# EAGLE design v1 (EAGLE 9.6.2)
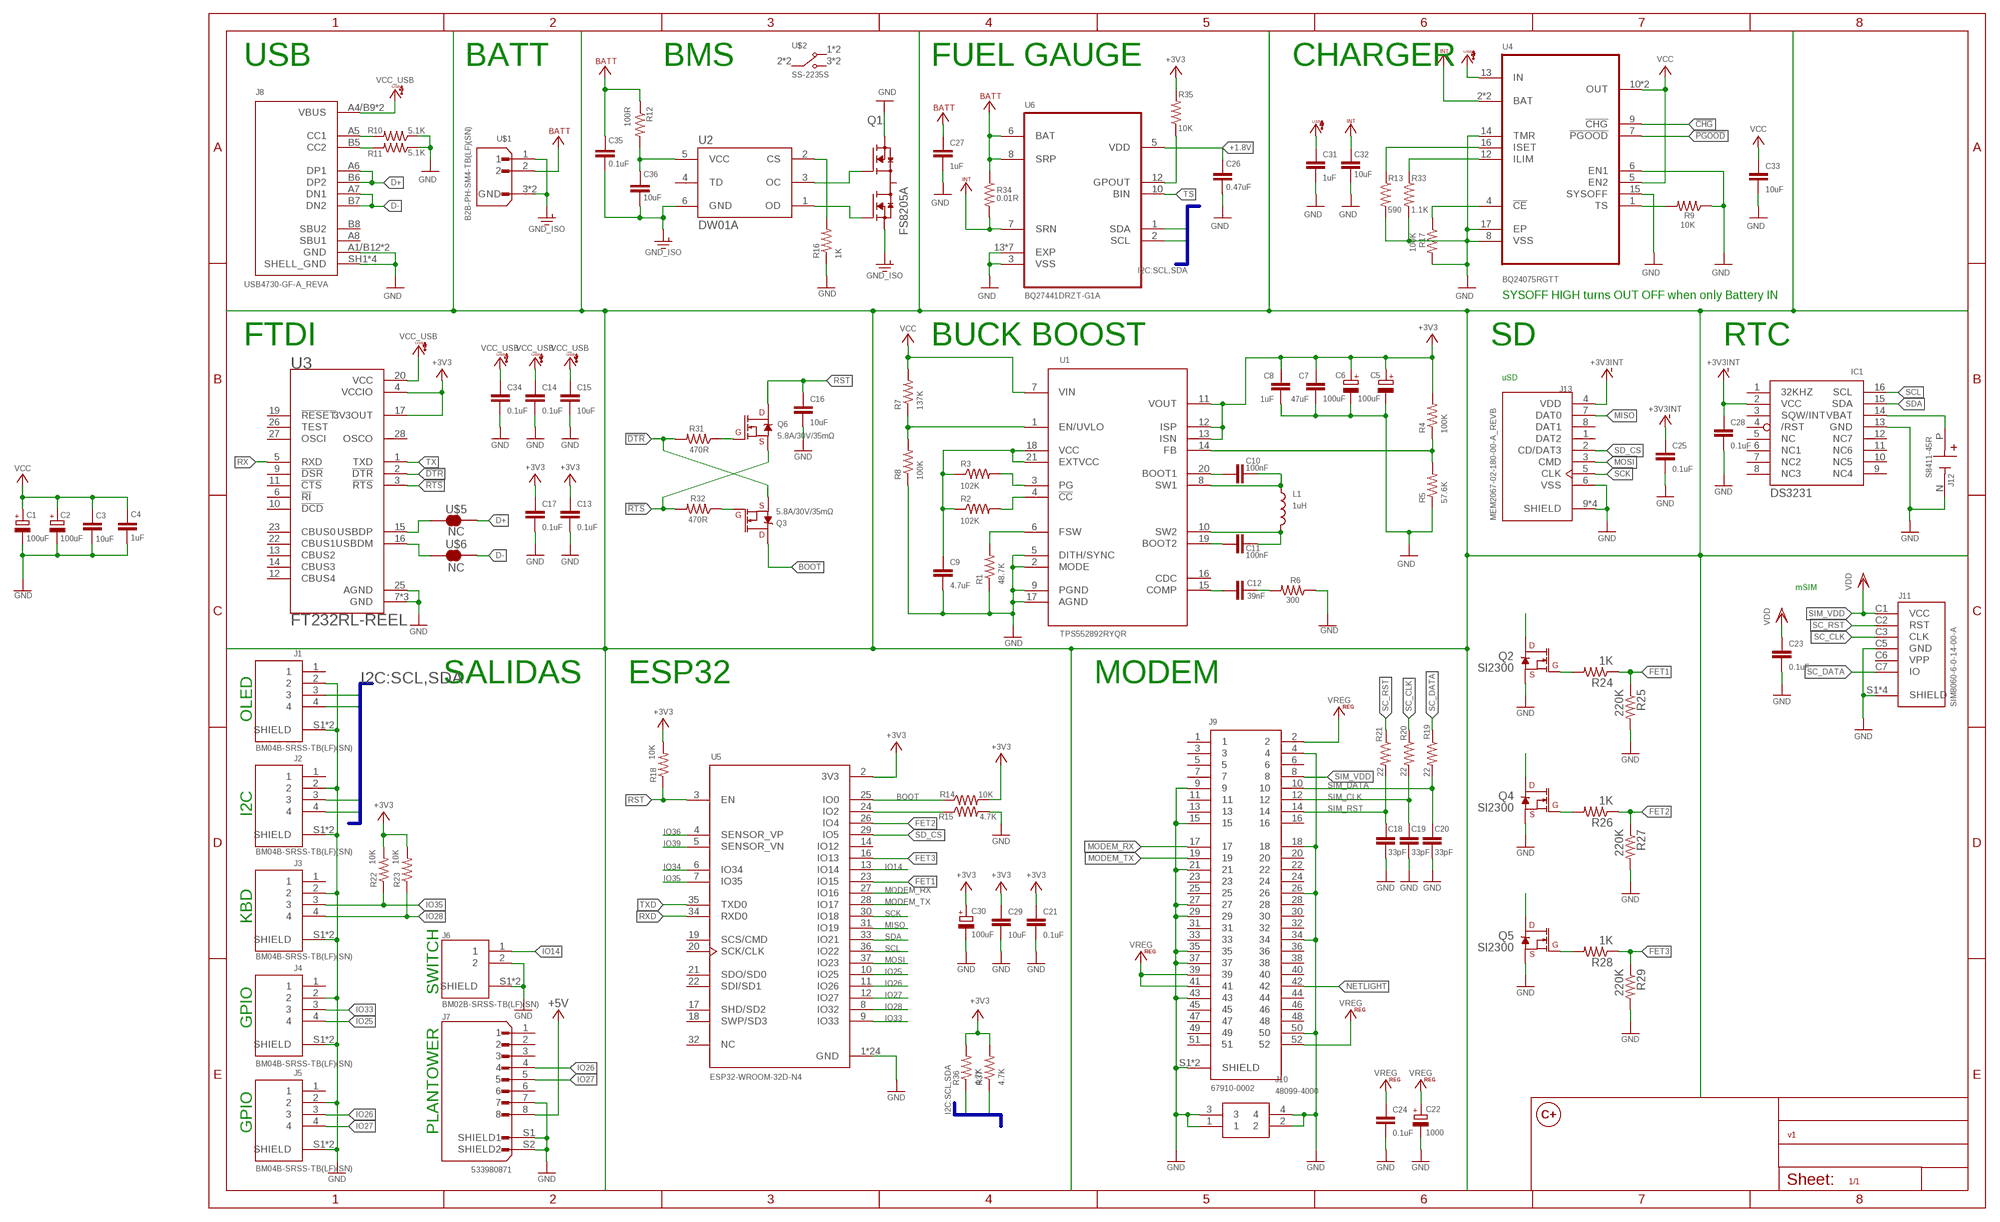
[diagram p0: schematic, sheet 1]

## Parts
C1  100uF  CPOL-EUSMCB  [SMC_B]
C2  100uF  CPOL-EUSMCB  [SMC_B]
C3  10uF  C-EUC0805  [C0805]
C4  1uF  C-EUC0805  [C0805]
C5  100uF  CPOL-EUSMCB  [SMC_B]
C6  100uF  CPOL-EUSMCB  [SMC_B]
C7  47uF  C-EUC0805  [C0805]
C8  1uF  C-EUC0805  [C0805]
C9  4.7uF  C-EUC0805  [C0805]
C10  100nF  C-EUC0805  [C0805]
C11  100nF  C-EUC0805  [C0805]
C12  39nF  C-EUC0805  [C0805]
C13  0.1uF  C-EUC0805  [C0805]
C14  0.1uF  C-EUC0805  [C0805]
C15  10uF  C-EUC0805  [C0805]
C16  10uF  C-EUC0805  [C0805]
C17  0.1uF  C-EUC0805  [C0805]
C18  33pF  C-EUC0805  [C0805]
C19  33pF  C-EUC0805  [C0805]
C20  33pF  C-EUC0805  [C0805]
C21  0.1uF  C-EUC0805  [C0805]
C22  1000  CPOL-EUSMCD  [SMC_D]
C23  0.1uF  C-EUC0805  [C0805]
C24  0.1uF  C-EUC0805  [C0805]
C25  0.1uF  C-EUC0805  [C0805]
C26  0.47uF  C-EUC0805  [C0805]
C27  1uF  C-EUC0805  [C0805]
C28  0.1uF  C-EUC0805  [C0805]
C29  10uF  C-EUC0805  [C0805]
C30  100uF  CPOL-EUCT3528  [CT3528]
C31  1uF  C-EUC0805  [C0805]
C32  10uF  C-EUC0805  [C0805]
C33  10uF  C-EUC0805  [C0805]
C34  0.1uF  C-EUC0805  [C0805]
C35  0.1uF  C-EUC0805  [C0805]
C36  10uF  C-EUC0805  [C0805]
IC1  DS3231/SO  [SO16W]
J1  BM04B-SRSS-TB(LF)(SN)  [JST_BM04B-SRSS-TB(LF)(SN)]
J2  BM04B-SRSS-TB(LF)(SN)  [JST_BM04B-SRSS-TB(LF)(SN)]
J3  BM04B-SRSS-TB(LF)(SN)  [JST_BM04B-SRSS-TB(LF)(SN)]
J4  BM04B-SRSS-TB(LF)(SN)  [JST_BM04B-SRSS-TB(LF)(SN)]
J5  BM04B-SRSS-TB(LF)(SN)  [JST_BM04B-SRSS-TB(LF)(SN)]
J6  BM02B-SRSS-TB(LF)(SN)  [JST_BM02B-SRSS-TB(LF)(SN)]
J7  533980871  [MOLEX_533980871]
J8  USB4730-GF-A_REVA  [GCT_USB4730-GF-A_REVA]
J9  67910-0002  [MOLEX_67910-0002]
J10  48099-4000  [480994000]
J11  SIM8060-6-0-14-00-A  [GCT_SIM8060-6-0-14-00-A]
J12  S8411-45R  [HARWIN_S8411-45R]
J13  MEM2067-02-180-00-A_REVB  [GCT_MEM2067-02-180-00-A_REVB]
L1  1uH  MDH7045C-220MA=P3  [IND_MDH7045C-220MA=P3]
Q1  FS8205A  FS8205ASOT95P280X145-6N  [SOT95P280X145-6N]
Q2  SI2300  MOSFET-NCH-AO3404A  [SOT23-3]
Q3  5.8A/30V/35mΩ  MOSFET-NCH-AO3404A  [SOT23-3]
Q4  SI2300  MOSFET-NCH-AO3404A  [SOT23-3]
Q5  SI2300  MOSFET-NCH-AO3404A  [SOT23-3]
Q6  5.8A/30V/35mΩ  MOSFET-NCH-AO3404A  [SOT23-3]
R1  48.7K  R-US_R0805  [R0805]
R2  102K  R-US_R0805  [R0805]
R3  102K  R-US_R0805  [R0805]
R4  100K  R-US_R0805  [R0805]
R5  57.6K  R-US_R0805  [R0805]
R6  300  R-US_R0805  [R0805]
R7  137K  R-US_R0805  [R0805]
R8  100K  R-US_R0805  [R0805]
R9  10K  R-US_R0805  [R0805]
R10  5.1K  R-US_R0805  [R0805]
R11  5.1K  R-US_R0805  [R0805]
R12  100R  R-US_R0805  [R0805]
R13  590  R-US_R0805  [R0805]
R14  10K  R-US_R0805  [R0805]
R15  4.7K  R-US_R0805  [R0805]
R16  1K  R-US_R0805  [R0805]
R17  100K  R-US_R0805  [R0805]
R18  10K  R-US_R0805  [R0805]
R19  22  R-US_R0805  [R0805]
R20  22  R-US_R0805  [R0805]
R21  22  R-US_R0805  [R0805]
R22  10K  R-US_R0805  [R0805]
R23  10K  R-US_R0805  [R0805]
R24  1K  R-US_R0805  [R0805]
R25  220K  R-US_R0805  [R0805]
R26  1K  R-US_R0805  [R0805]
R27  220K  R-US_R0805  [R0805]
R28  1K  R-US_R0805  [R0805]
R29  220K  R-US_R0805  [R0805]
R31  470R  R-US_R0805  [R0805]
R32  470R  R-US_R0805  [R0805]
R33  1.1K  R-US_R0805  [R0805]
R34  0.01R  R-US_R1206  [R1206]
R35  10K  R-US_R0805  [R0805]
R36  4.7K  R-US_R0805  [R0805]
R37  4.7K  R-US_R0805  [R0805]
U1  TPS552892RYQR  [CONV_TPS552892RYQR]
U2  DW01A  [SOT23-6]
U3  FT232RL-REEL  [SOP65P780X200-28N]
U4  BQ24075RGTT  [QFN50P300X300X100-17N]
U5  ESP32-WROOM-32D-N4  [MODULE_ESP32-WROOM-32D-N4]
U6  BQ27441DRZT-G1A  [IC_BQ27441DRZR-G1A]
U$1  B2B-PH-SM4-TB(LF)(SN)  [JST_B2B-PH-SM4-TB(LF)(SN)]
U$2  SS-2235S  [SS-2235S]
U$3  LOGO_CMAS10MM  [LOGO_10MM]
U$5  NC  SMT-JUMPER-2_NC  [SMT-JUMPER-2_NC]
U$6  NC  SMT-JUMPER-2_NC  [SMT-JUMPER-2_NC]

## Nets
!CHG: U4.9(!CHG)
!DTR: Q3.2(S) R31.2 U3.2(!DTR)
!PGOOD: U4.7(!PGOOD)
!RTS: Q6.2(S) R32.2 U3.3(!RTS)
+1.8V: C26.1 U6.5(VDD)
+3V3: C5.+ C6.+ C7.1 C8.1 C13.1 C17.1 C21.1 C29.1 C30.+ R4.2 R14.2 R18.2 R22.2 R23.2 R35.2 R36.2 R37.2 U1.11(VOUT) U1.12(ISP) U1.13(ISN) U3.4(VCCIO) U3.17(3V3OUT) U5.2(3V3)
+3V3INT: C25.1 C28.1 IC1.2(VCC) J13.4(VDD)
+5V: J7.8
BOOT: Q3.3(D) R14.1 U5.25(IO0)
D+: J8.A6(DP1) J8.B6(DP2) U$5.2
D-: J8.A7(DN1) J8.B7(DN2) U$6.2
FET1: R24.1 R25.1 U5.23(IO15)
FET2: R26.1 R27.1 U5.26(IO4)
FET3: R28.1 R29.1 U5.16(IO13)
GND: C1.- C2.- C3.2 C4.2 C5.- C6.- C7.2 C8.2 C9.2 C13.2 C14.2 C15.2 C16.2 C17.2 C18.2 C19.2 C20.2 C21.2 C22.- C23.2 C24.2 C25.2 C26.2 C27.2 C28.2 C29.2 C30.- C31.2 C32.2 C33.2 C34.2 IC1.13(GND) J1.2 J1.S1(SHIELD) J1.S2(SHIELD) J2.2 J2.S1(SHIELD) J2.S2(SHIELD) J3.2 J3.S1(SHIELD) J3.S2(SHIELD) J4.2 J4.S1(SHIELD) J4.S2(SHIELD) J5.2 J5.S1(SHIELD) J5.S2(SHIELD) J6.2 J6.S1(SHIELD) J6.S2(SHIELD) J7.7 J7.S1(SHIELD1) J7.S2(SHIELD2) J8.A1/B12(GND) J8.B1/A12(GND) J8.SH1(SHELL_GND) J8.SH2(SHELL_GND) J8.SH3(SHELL_GND) J8.SH4(SHELL_GND) J9.4 J9.9 J9.15 J9.18 J9.21 J9.26 J9.27 J9.29 J9.34 J9.35 J9.37 J9.43 J9.50 J9.S1(SHIELD) J9.S2(SHIELD) J10.1 J10.2 J10.3 J10.4 J11.C5(GND) J11.S1(SHIELD) J11.S2(SHIELD) J11.S3(SHIELD) J11.S4(SHIELD) J12.N(-) J13.6(VSS) J13.9(SHIELD) J13.10(SHIELD) J13.11(SHIELD) J13.12(SHIELD) Q1.3(S2) Q2.2(S) Q4.2(S) Q5.2(S) R1.1 R5.1 R6.1 R8.1 R9.1 R10.1 R11.1 R13.2 R15.2 R16.1 R17.2 R25.2 R27.2 R29.2 R33.2 U1.2(MODE) U1.5(DITH/SYNC) U1.9(PGND) U1.17(AGND) U3.7(GND) U3.18(GND) U3.21(GND) U3.25(AGND) U4.6(EN1) U4.8(VSS) U4.14(TMR) U4.15(SYSOFF) U4.17(EP) U5.1(GND) U5.15(GND) U5.38(GND) U5.39_1(GND) U5.39_2(GND) U5.39_3(GND) U5.39_4(GND) U5.39_5(GND) U5.39_6(GND) U5.39_7(GND) U5.39_8(GND) U5.39_9(GND) U5.39_10(GND) U5.39_11(GND) U5.39_12(GND) U5.39_13(GND) U5.39_14(GND) U5.39_15(GND) U5.39_16(GND) U5.39_17(GND) U5.39_18(GND) U5.39_19(GND) U5.39_20(GND) U5.39_21(GND) U6.3(VSS) U6.13(EXP) U6.14(EXP) U6.15(EXP) U6.16(EXP) U6.17(EXP) U6.18(EXP) U6.19(EXP)
GND_ISO: C35.2 C36.2 Q1.1(S1) U2.6(GND) U$1.1 U$1.3(GND) U$1.4(GND)
GPOUT: R35.1 U6.12(GPOUT)
IO14: J6.1 U5.13(IO14)
IO25: J4.4 U5.10(IO25)
IO26: J5.3 J7.4 U5.11(IO26)
IO27: J5.4 J7.5 U5.12(IO27)
IO28: J3.4 R23.1 U5.8(IO32)
IO33: J4.3 U5.9(IO33)
IO34: U5.6(IO34)
IO35: J3.3 R22.1 U5.7(IO35)
IO36: U5.4(SENSOR_VP)
IO39: U5.5(SENSOR_VN)
MISO: J13.7(DAT0) U5.31(IO19)
MODEM_RX: J9.17 U5.27(IO16)
MODEM_TX: J9.19 U5.28(IO17)
MOSI: J13.3(CMD) U5.37(IO23)
N$1: R2.2 U1.4(!CC)
N$2: C12.1 U1.15(COMP)
N$3: C12.2 R6.2
N$4: R1.2 U1.6(FSW)
N$5: R3.2 U1.3(PG)
N$6: C9.1 R2.1 R3.1 U1.18(VCC) U1.21(EXTVCC)
N$7: R4.1 R5.2 U1.14(FB)
N$8: C11.2 L1.2 U1.10(SW2)
N$9: C10.1 U1.20(BOOT1)
N$10: C10.2 L1.1 U1.8(SW1)
N$11: C11.1 U1.19(BOOT2)
N$12: R7.1 R8.2 U1.1(EN/UVLO)
N$13: J8.A5(CC1) R10.2
N$14: J8.B5(CC2) R11.2
N$15: Q1.4(G2) U2.3(OC)
N$16: Q1.6(G1) U2.1(OD)
N$17: C36.1 R12.2 U2.5(VCC)
N$18: IC1.14(VBAT) J12.P(+)
N$19: U3.15(USBDP) U$5.1
N$20: U3.16(USBDM) U$6.1
N$21: R9.2 U4.1(TS)
N$22: R13.1 U4.16(ISET)
N$23: R33.1 U4.12(ILIM)
N$24: R15.1 U5.24(IO2)
N$25: Q6.1(G) R31.1
N$26: Q3.1(G) R32.1
N$27: R16.2 U2.2(CS)
N$28: R17.1 U4.4(!CE)
N$30: Q2.3(D)
N$31: Q2.1(G) R24.2
N$32: Q4.3(D)
N$33: Q4.1(G) R26.2
N$34: Q5.3(D)
N$35: Q5.1(G) R28.2
NETLIGHT: J9.42
RST: C16.1 Q6.3(D) R18.1 U5.3(EN)
RX: U3.5(RXD)
RXD: U5.34(RXD0)
SC_CLK: J11.C3(CLK) R20.1
SC_DATA: J11.C7(IO) R19.1
SC_RST: J11.C2(RST) R21.1
SCK: J13.5(CLK) U5.30(IO18)
SCL: IC1.16(SCL) J1.4 J2.4 R37.1 U5.36(IO22) U6.2(SCL)
SD_CS: J13.2(CD/DAT3) U5.29(IO5)
SDA: IC1.15(SDA) J1.3 J2.3 R36.1 U5.33(IO21) U6.1(SDA)
SIM_CLK: C19.1 J9.12 R20.2
SIM_DATA: C20.1 J9.10 R19.2
SIM_RST: C18.1 J9.14 R21.2
SIM_VDD: C23.1 J9.8 J11.C1(VCC) ; supply symbol labelled VDD
TS: U6.10(BIN)
TX: U3.1(TXD)
TXD: U5.35(TXD0)
VBAT: C27.1 C35.1 R12.1 R34.1 U6.6(BAT) U6.8(SRP) U$1.2
VCC: C1.+ C2.+ C3.1 C4.1 C33.1 R7.2 U1.7(VIN) U4.5(EN2) U4.10(OUT) U4.11(OUT)
VCC_USB: C14.1 C15.1 C31.1 C34.1 J8.A4/B9(VBUS) J8.B4/A9(VBUS) U3.20(VCC) U4.13(IN)
VCCINT: C32.1 R34.2 U4.2(BAT) U4.3(BAT) U6.7(SRN)
VREG: C22.+ C24.1 J9.2 J9.39 J9.41 J9.52
Unconnected: IC1.1(32KHZ) IC1.3(SQW/INT) IC1.4(/RST) IC1.5(NC) IC1.6(NC1) IC1.7(NC2) IC1.8(NC3) IC1.9(NC4) IC1.10(NC5) IC1.11(NC6) IC1.12(NC7) J1.1 J2.1 J3.1 J4.1 J5.1 J7.1 J7.2 J7.3 J7.6 J8.A8(SBU1) J8.B8(SBU2) J9.1 J9.3 J9.5 J9.6 J9.7 J9.11 J9.13 J9.16 J9.20 J9.22 J9.23 J9.24 J9.25 J9.28 J9.30 J9.31 J9.32 J9.33 J9.36 J9.38 J9.40 J9.44 J9.45 J9.46 J9.47 J9.48 J9.49 J9.51 J11.C6(VPP) J13.1(DAT2) J13.8(DAT1) Q1.2(D12) Q1.5(D12) U1.16(CDC) U2.4(TD) U3.6(!RI) U3.9(!DSR) U3.10(!DCD) U3.11(!CTS) U3.12(CBUS4) U3.13(CBUS2) U3.14(CBUS3) U3.19(!RESET) U3.22(CBUS1) U3.23(CBUS0) U3.26(TEST) U3.27(OSCI) U3.28(OSCO) U5.14(IO12) U5.17(SHD/SD2) U5.18(SWP/SD3) U5.19(SCS/CMD) U5.20(SCK/CLK) U5.21(SDO/SD0) U5.22(SDI/SD1) U5.32(NC) U$2.1(T1) U$2.2(P1) U$2.3(T2) U$2.4(T1) U$2.5(P1) U$2.6(T2)

## Buses
I2C:SCL,SDA

## Notes on the sheet
- USB | BATT | BMS | FUEL GAUGE | CHARGER
- SYSOFF HIGH turns OUT OFF when only Battery IN
- FTDI | BUCK BOOST | SD | RTC
- uSD
- mSIM
- SALIDAS | ESP32 | MODEM
- OLED
- I2C
- KBD
- SWITCH
- GPIO
- GPIO | PLANTOWER

## Library data of the parts
C1 C2 C5 C6 C22 C30 = rcl:CPOL-EU: POLARIZED CAPACITOR, European symbol; SPICEPREFIX: C
C3 C4 C7-C21 C23-C29 C31-C36 = rcl:C-EU: CAPACITOR, European symbol; SPICEPREFIX: C
IC1 = DS3231:DS3231: Check availability <https://pricing.snapeda.com/parts/DS3231/Analog%20Devices/view-part?ref=eda>; AVAILABILITY: In Stock; CHECK_PRICES: https://www.snapeda.com/parts/DS3231/Analog+Devices/view-part/?ref=eda; DESCRIPTION: Real Time Clock (RTC) IC Clock/Calendar - I²C, 2-Wire Serial 8-SOIC (0.154, 3.90mm Width); MF: Analog Devices; MP: DS3231; PACKAGE: SOIC-16 Maxim Integrated; PRICE: None; SNAPEDA_LINK: https://www.snapeda.com/parts/DS3231/Analog+Devices/view-part/?ref=snap
J1-J5 = con-jst_sh:BM04B-SRSS-TB(LF)(SN): Check availability <https://pricing.snapeda.com/parts/BM04B-SRSS-TB%28LF%29%28SN%29/JST%20Sales/view-part?ref=eda>; AVAILABILITY: In Stock; CHECK_PRICES: https://www.snapeda.com/parts/BM04B-SRSS-TB(LF)(SN)/JST/view-part/?ref=eda; DESCRIPTION: Connector Header Surface Mount 4 position 0.039 (1.00mm); MF: JST Sales; MP: BM04B-SRSS-TB(LF)(SN); PACKAGE: None; PRICE: None; SNAPEDA_LINK: https://www.snapeda.com/parts/BM04B-SRSS-TB(LF)(SN)/JST/view-part/?ref=snap
J6 = con-jst_sh:BM02B-SRSS-TB(LF)(SN): Check availability <https://pricing.snapeda.com/parts/BM02B-SRSS-TB%20%28LF%29%28SN%29/JST%20Corporation/view-part?ref=eda>; AVAILABILITY: In Stock; CHECK_PRICES: https://www.snapeda.com/parts/BM02B-SRSS-TB%20(LF)(SN)/JST/view-part/?ref=eda; DESCRIPTION: Connector Header Surface Mount 2 position 0.039 (1.00mm); MF: JST Corporation; MP: BM02B-SRSS-TB (LF)(SN); PACKAGE: None; PRICE: None; SNAPEDA_LINK: https://www.snapeda.com/parts/BM02B-SRSS-TB%20(LF)(SN)/JST/view-part/?ref=snap
J7 = 533980871:533980871: Check availability <https://pricing.snapeda.com/parts/53398-0871/Molex/view-part?ref=eda>; AVAILABILITY: In Stock; CHECK_PRICES: https://www.snapeda.com/parts/53398-0871/Molex/view-part/?ref=eda; DESCRIPTION: Conn; Rect; Header; 1.25 mm Pitch; PCB; 8 Cir; Ver; SMT; PicoBlade; LF | Molex Incorporated 53398-0871; MF: Molex; MP: 53398-0871; PACKAGE: None; PRICE: None; SNAPEDA_LINK: https://www.snapeda.com/parts/53398-0871/Molex/view-part/?ref=snap
J8 = con-usb:USB4730-GF-A_REVA: Check availability <https://pricing.snapeda.com/parts/USB4730-GF-A/Global%20Connector%20Technology/view-part?ref=eda>; AVAILABILITY: In Stock; CHECK_PRICES: https://www.snapeda.com/parts/USB4730-GF-A/Global+Connector+Technology/view-part/?ref=eda; DESCRIPTION: USB-C (USB TYPE-C) USB 2.0 Receptacle Connector 24 (16+8 Dummy) Position Surface Mount, Right Angle; Through Hole; LCSC: C5446865; MF: Global Connector Technology; MP: USB4730-GF-A; PACKAGE: None; PRICE: None; SNAPEDA_LINK: https://www.snapeda.com/parts/USB4730-GF-A/Global+Connector+Technology/view-part/?ref=snap
J9 = 67910-0002:67910-0002: 52 Position Female Connector PCI Express Mini Card Gold 0.031" (0.80mm) Black Check prices <https://pricing.snapeda.com/parts/67910-0002/Molex/view-part?ref=eda>; AVAILABILITY: In Stock; DESCRIPTION: 52 Position Female Connector PCI Express Mini Card Gold 0.031 (0.80mm) Black; MF: Molex; MP: 67910-0002; PACKAGE: None; PRICE: None
J10 = mPCIe:48099-4000: Molex 48099 Series, Card Holder for use with Mini PCIe, PCI Source: Datasheet <https://media.digikey.com/pdf/Data Sheets/Molex PDFs/480994000_Dwg.pdf>; DESCRIPTION: Molex 48099 Series, Card Holder for use with Mini PCIe, PCI; HEIGHT: 4.8mm; MANUFACTURER_NAME: Molex; MANUFACTURER_PART_NUMBER: 48099-4000; MOUSER_PART_NUMBER: 538-48099-4000; MOUSER_PRICE-STOCK: https://www.mouser.co.uk/ProductDetail/Molex/48099-4000?qs=dsreSLQWyj8b%2FXEoksc%2Fog%3D%3D
J11 = simCardHolder:SIM8060-6-0-14-00-A: SIM8060 is a hinged Sim Card Connector. With 6 contacts, with switch for card detection. Profile above PCB is 1.43mm. Check availability <https://pricing.snapeda.com/parts/SIM8060-6-0-14-00-A/Global%20Connector%20Technology/view-part?ref=eda>; AVAILABILITY: In Stock; CHECK_PRICES: https://www.snapeda.com/parts/SIM8060-6-0-14-00-A/Global+Connector+Technology/view-part/?ref=eda; DESCRIPTION: 6 Position Card Connector NANO SIM Surface Mount, Right Angle Gold; MF: Global Connector Technology; MP: SIM8060-6-0-14-00-A; PACKAGE: None; PRICE: None; SNAPEDA_LINK: https://www.snapeda.com/parts/SIM8060-6-0-14-00-A/Global+Connector+Technology/view-part/?ref=snap
J12 = S8411-45R:S8411-45R: Check availability <https://pricing.snapeda.com/parts/S8411-45R/Harwin/view-part?ref=eda>; AVAILABILITY: In Stock; CHECK_PRICES: https://www.snapeda.com/parts/S8411-45R/Harwin/view-part/?ref=eda; DESCRIPTION: Coin Cell Battery Retainer, Horizontal SMT, for CR1220 Coin Cell Batteries, Tape & Reeled; MF: Harwin; MP: S8411-45R; PACKAGE: None; PRICE: None; SNAPEDA_LINK: https://www.snapeda.com/parts/S8411-45R/Harwin/view-part/?ref=snap
J13 = microsd:MEM2067-02-180-00-A_REVB: Check availability <https://pricing.snapeda.com/parts/MEM2067-02-180-00-A/Global%20Connector%20Technology/view-part?ref=eda>; AVAILABILITY: In Stock; CHECK_PRICES: https://www.snapeda.com/parts/MEM2067-02-180-00-A/Global+Connector+Technology/view-part/?ref=eda; DESCRIPTION: 8 Position Card Connector microSD Surface Mount, Right Angle Gold; MF: Global Connector Technology; MP: MEM2067-02-180-00-A; PACKAGE: None; PRICE: None; SNAPEDA_LINK: https://www.snapeda.com/parts/MEM2067-02-180-00-A/Global+Connector+Technology/view-part/?ref=snap
L1 = MDH7045C-220MA_P3:MDH7045C-220MA=P3: Inductor Power Shielded Wirewound 100uH 20% 100KHz Ferrite 0.8A 0.377Ohm DCR 2928 Automotive T/R Check availability <https://pricing.snapeda.com/parts/MDH7045C-220MA%3DP3/Murata/view-part?ref=eda>; AVAILABILITY: In Stock; CHECK_PRICES: https://www.snapeda.com/parts/MDH7045C-220MA=P3/Murata/view-part/?ref=eda; DESCRIPTION: Inductor with Inductance: 22uH Tol. +/-20%, Package: 2928 (7470); MF: Murata; MP: MDH7045C-220MA=P3; PACKAGE: NONSTANDARD; PRICE: None; SNAPEDA_LINK: https://www.snapeda.com/parts/MDH7045C-220MA=P3/Murata/view-part/?ref=snap
Q1 = FS8205A:FS8205A: N/A Check availability <https://pricing.snapeda.com/parts/FS8205A/Fortune%20Semiconductor/view-part?ref=eda>
Q2 Q4 Q5 = transistor:MOSFET-NCH: N-channel MOSFETs Voltage controlled devices that allow control of high current outputs. SparkFun Products: SparkFun OpenScale <https://www.sparkfun.com/products/13261> SparkFun Digital Sandbox <https://www.sparkfun.com/products/12651> SparkFun Monster Moto Shield <https://www.sparkfun.com/products/10182> SparkFun MOSFET Power Controller <https://www.sparkfun.com/products/11214>; PROD_ID: TRANS-12988; VALUE: 5.8A/30V/35mΩ
Q3 Q6 = transistor:MOSFET-NCH: N-channel MOSFETs Voltage controlled devices that allow control of high current outputs. SparkFun Products: SparkFun OpenScale <https://www.sparkfun.com/products/13261> SparkFun Digital Sandbox <https://www.sparkfun.com/products/12651> SparkFun Monster Moto Shield <https://www.sparkfun.com/products/10182> SparkFun MOSFET Power Controller <https://www.sparkfun.com/products/11214>; PROD_ID: TRANS-12988
R1-R29 R31-R37 = rcl:R-US_: RESISTOR, American symbol; SPICEPREFIX: R
U1 = TPS552892RYQR:TPS552892RYQR: Check availability <https://pricing.snapeda.com/parts/TPS552892RYQR/Texas%20Instruments/view-part?ref=eda>; AVAILABILITY: In Stock; CHECK_PRICES: https://www.snapeda.com/parts/TPS552892RYQR/Texas+Instruments/view-part/?ref=eda; DESCRIPTION: 36-V 8-A fully-integrated buck-boost converter; MF: Texas Instruments; MP: TPS552892RYQR; PACKAGE: None; PRICE: None; SNAPEDA_LINK: https://www.snapeda.com/parts/TPS552892RYQR/Texas+Instruments/view-part/?ref=snap
U2 = DW01A:DW01A: The DW01A battery protection IC is designed to protect lithium-ion/polymer battery from damage or degrading the lifetime due to overcharge, overdischarge, and/or overcurrent for one-cell lithium-ion/polymer battery powered systems, such as cellular phones. Check availability <https://pricing.snapeda.com/parts/DW01A/Fortune%20Semiconductor/view-part?ref=eda>; AVAILABILITY: Not in stock; CHECK_PRICES: https://www.snapeda.com/parts/DW01A/Fortune+Semiconductor/view-part/?ref=eda; DESCRIPTION: One Cell Lithium-ion/Polymer Battery Protection IC; MF: Fortune Semiconductor; MP: DW01A; PACKAGE: SOT-23-6 Fortune Semiconductor; PRICE: None; SNAPEDA_LINK: https://www.snapeda.com/parts/DW01A/Fortune+Semiconductor/view-part/?ref=snap
U3 = FT232RL-REEL:FT232RL-REEL: USB Full Speed to Serial UART IC, Includes Oscillator and EEPROM - SSOP-28 Check availability <https://pricing.snapeda.com/parts/FT232RL-REEL/FTDI%2C/view-part?ref=eda>; AVAILABILITY: In Stock; CHECK_PRICES: https://www.snapeda.com/parts/FT232RL-REEL/FTDI%252C+Future+Technology+Devices+International+Ltd/view-part/?ref=eda; DESCRIPTION: USB Bridge, USB to UART USB 2.0 UART Interface 28-SSOP; MF: FTDI,; MP: FT232RL-REEL; PACKAGE: SSOP-28 FTDI; PRICE: None; PURCHASE-URL: https://pricing.snapeda.com/search?q=FT232RL-REEL&ref=eda; SNAPEDA_LINK: https://www.snapeda.com/parts/FT232RL-REEL/FTDI%252C+Future+Technology+Devices+International+Ltd/view-part/?ref=snap
U4 = BQ24075RGTT:BQ24075RGTT: Check availability <https://pricing.snapeda.com/parts/BQ24075RGTT/Texas%20Instruments/view-part?ref=eda>; AVAILABILITY: In Stock; CHECK_PRICES: https://www.snapeda.com/parts/BQ24075RGTT/Texas+Instruments/view-part/?ref=eda; DESCRIPTION: Standalone 1-cell 1.5-A linear battery charger, Power Path, 4.2-V VBAT and 5.5-V VOUT; MF: Texas Instruments; MP: BQ24075RGTT; PACKAGE: VQFN-16 Texas Instruments; PRICE: None; SNAPEDA_LINK: https://www.snapeda.com/parts/BQ24075RGTT/Texas+Instruments/view-part/?ref=snap
U5 = ESP32-WROOM-32D-N4:ESP32-WROOM-32D-N4: Check availability <https://pricing.snapeda.com/parts/ESP32-WROOM-32D-N4/Espressif%20Systems/view-part?ref=eda>; AVAILABILITY: In Stock; CHECK_PRICES: https://www.snapeda.com/parts/ESP32-WROOM-32D-N4/Espressif+Systems/view-part/?ref=eda; DESCRIPTION: Bluetooth, WiFi 802.11b/g/n, Bluetooth v4.2 +EDR, Class 1, 2 and 3 Transceiver Module 2.4GHz ~ 2.5GHz Integrated, Trace Surface Mount; MF: Espressif Systems; MP: ESP32-WROOM-32D-N4; PACKAGE: Non Standard Espressif Systems; PRICE: None; SNAPEDA_LINK: https://www.snapeda.com/parts/ESP32-WROOM-32D-N4/Espressif+Systems/view-part/?ref=snap
U6 = BQ27441DRZT-G1A:BQ27441DRZT-G1A: Check availability <https://pricing.snapeda.com/parts/BQ27441DRZT-G1A/Texas%20Instruments/view-part?ref=eda>; AVAILABILITY: In Stock; CHECK_PRICES: https://www.snapeda.com/parts/BQ27441DRZT-G1A/Texas+Instruments/view-part/?ref=eda; DESCRIPTION: System-side Impedance Track™ battery fuel (gas) gauge; MF: Texas Instruments; MP: BQ27441DRZT-G1A; PACKAGE: VSON-12 Texas Instruments; PRICE: None; SNAPEDA_LINK: https://www.snapeda.com/parts/BQ27441DRZT-G1A/Texas+Instruments/view-part/?ref=snap
U$1 = con-jst_ph:B2B-PH-SM4-TB(LF)(SN): Japan solderless terminals. 2mm pitch, 2 pins. Check availability <https://pricing.snapeda.com/parts/B2B-PH-SM4-TB%28LF%29%28SN%29/JST%20Sales/view-part?ref=eda>; AVAILABILITY: In Stock; CHECK_PRICES: https://www.snapeda.com/parts/B2B-PH-SM4-TB(LF)(SN)/JST+Sales+America+Inc./view-part/?ref=eda; DESCRIPTION: Connector Header Surface Mount 2 position 0.079 (2.00mm); MF: JST Sales; MP: B2B-PH-SM4-TB(LF)(SN); PACKAGE: NON STANDARD-2 JST; PRICE: None; SNAPEDA_LINK: https://www.snapeda.com/parts/B2B-PH-SM4-TB(LF)(SN)/JST+Sales+America+Inc./view-part/?ref=snap
U$2 = switch_slide:SS-2235S
U$3 = logoCmas:LOGO_CMAS
U$5 U$6 = solderpad:SMT-JUMPER-2_NC

## Net classes
0 default: width 0.61 mm

## Board
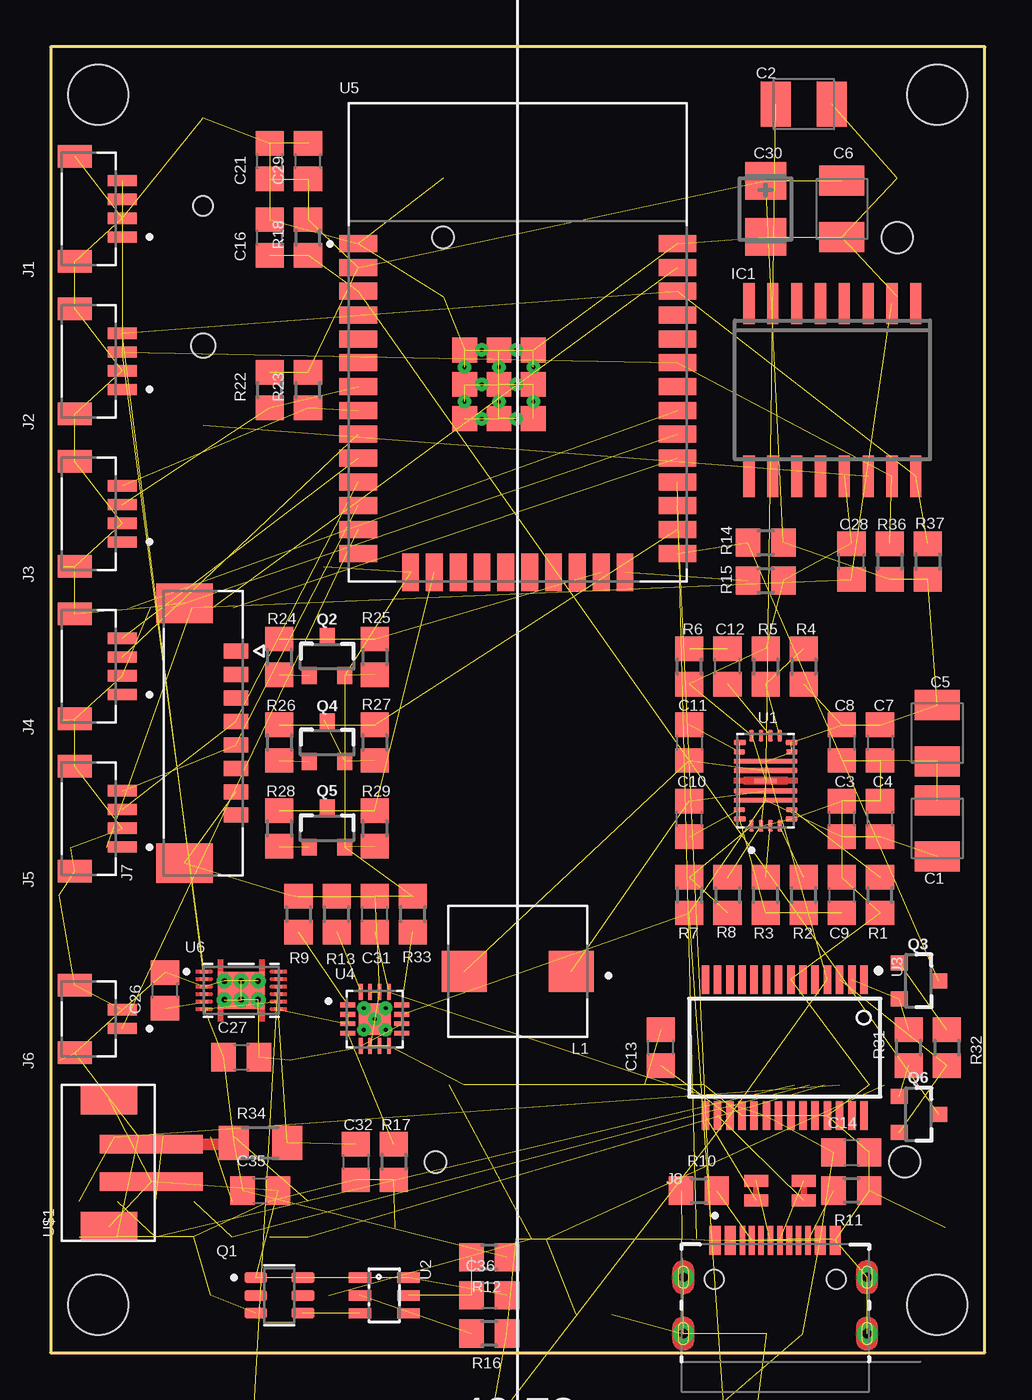
[diagram p1: board, top side]
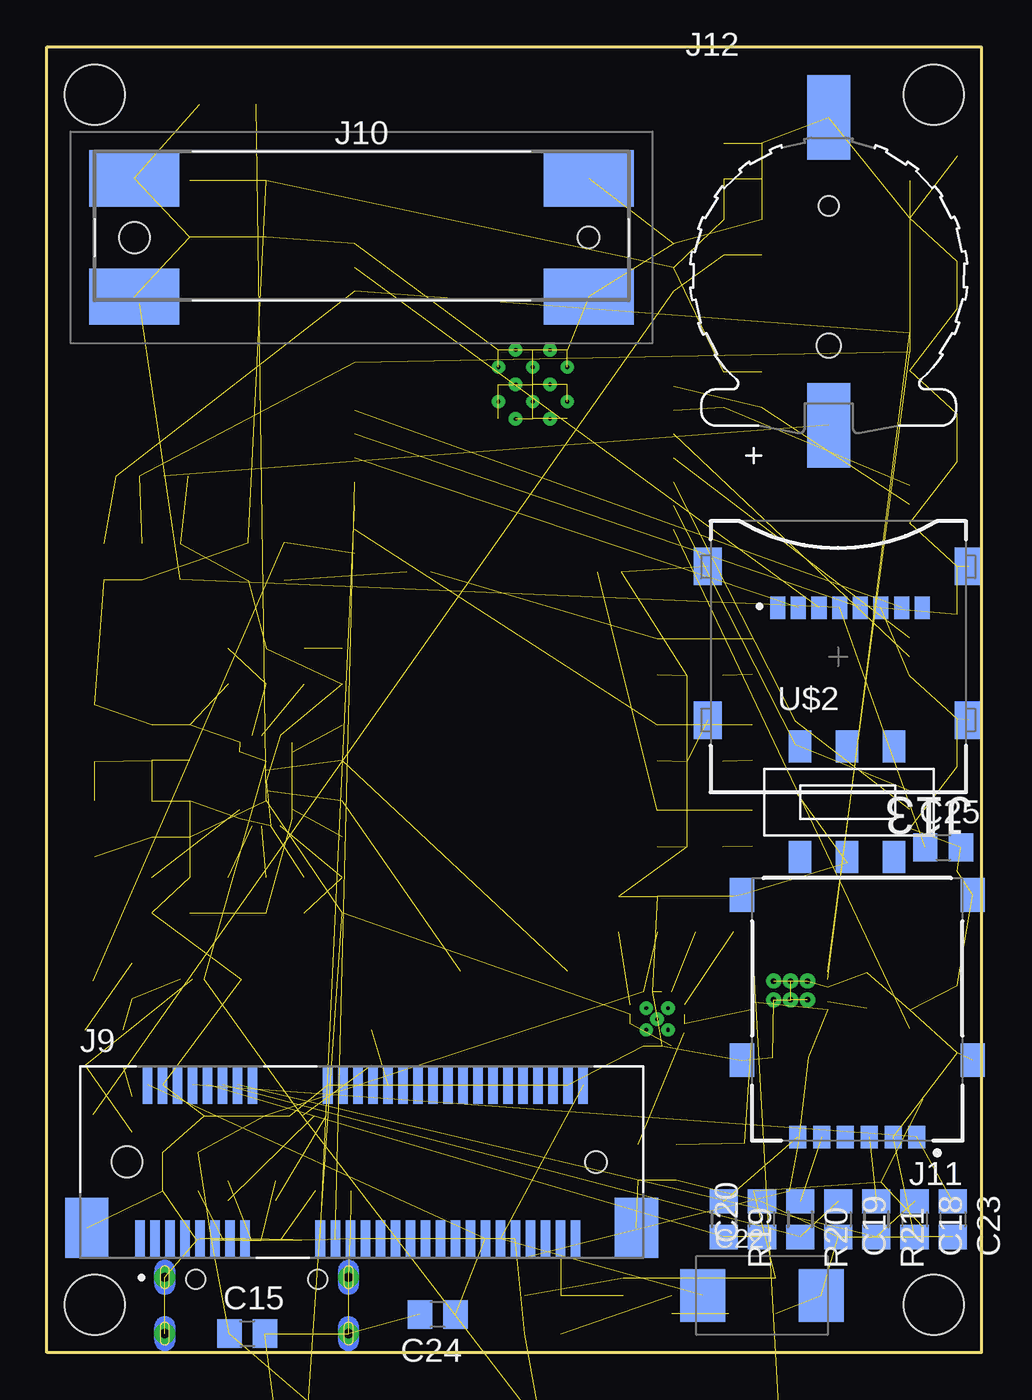
[diagram p2: board, bottom side, seen from below]

Size 49.78 x 69.6 mm. Coordinates in mm from the lower left corner, seen from the top.
Outline: 0,69.6 0,0 49.78,0 49.78,69.6 0,69.6
Copper layers (1*16): Top 0.035mm / dielectric 1.5mm / Bottom 0.035mm
Design rules "OthermillDRC_30_deg_005": minimum track width 6mil, minimum drill 0.8mm, track to track 8mil, track to pad 8mil, pad to pad 8mil, via to via 8mil, smd to smd 0mil, copper to edge 0mil, drill to drill 6mil, minimum pad ring 10mil, minimum via ring 10mil, stop-mask expansion 1mil, vias tented up to drill 30mil, thermal gap 6mil
Holes 3.2 mm at 2.54,67.06 47.24,2.54 47.24,67.06 2.54,2.54

### Footprints (pad centres in the part's own frame; a part is rotated, then mirrored left to right if it is on the bottom)
SMC_B = smd 1.6 x 2.4: + -1.5,0; - 1.5,0
C0805 = smd 1.3 x 1.5: 1 -0.95,0; 2 0.95,0
SMC_D = smd 2.4 x 2.8: + -3.15,0; - 3.15,0
CT3528 = smd 2 x 2.2: + -1.5,0; - 1.5,0
SO16W = smd 0.6 x 2.2: 1 -4.445,-4.6; 2 -3.175,-4.6; 3 -1.905,-4.6; 4 -0.635,-4.6; 5 0.635,-4.6; 6 1.905,-4.6; 7 3.175,-4.6; 8 4.445,-4.6; 9 4.445,4.6; 10 3.175,4.6; 11 1.905,4.6; 12 0.635,4.6; 13 -0.635,4.6; 14 -1.905,4.6; 15 -3.175,4.6; 16 -4.445,4.6
JST_BM04B-SRSS-TB(LF)(SN) = smd 0.6 x 1.55: 1 -1.5,-1.775; 2 -0.5,-1.775; 3 0.5,-1.775; 4 1.5,-1.775 | smd 1.2 x 1.8: S1 -2.8,0.75; S2 2.8,0.75
JST_BM02B-SRSS-TB(LF)(SN) = smd 0.6 x 1.55: 1 -0.5,-1.775; 2 0.5,-1.775 | smd 1.2 x 1.8: S1 -1.8,0.75; S2 1.8,0.75
MOLEX_533980871 = smd 0.8 x 1.3: 1 4.375,-1.75; 2 3.125,-1.75; 3 1.875,-1.75; 4 0.625,-1.75; 5 -0.625,-1.75; 6 -1.875,-1.75; 7 -3.125,-1.75; 8 -4.375,-1.75 | smd 2.1 x 3: S1 -6.925,1; S2 6.925,1
GCT_USB4730-GF-A_REVA = smd 0.6 x 1.55: A1/B12 -3.2,4.975; A4/B9 -2.4,4.975; B1/A12 3.2,4.975; B4/A9 2.4,4.975 | smd 0.3 x 1.55: A5 -1.25,4.975; A6 -0.25,4.975; A7 0.25,4.975; A8 1.25,4.975; B5 1.75,4.975; B6 0.75,4.975; B7 -0.75,4.975; B8 -1.75,4.975 | drill 0.5 pad 1.1: SH1 -4.895,0; SH2 4.895,0; SH3 -4.895,3; SH4 4.895,3 | hole 1.02: -3.25,2.9; 3.25,2.9
MOLEX_67910-0002 = smd 0.508 x 2: 1 -11.8,-4.1; 2 -11.4,4.1; 3 -11,-4.1; 4 -10.6,4.1; 5 -10.2,-4.1; 6 -9.8,4.1; 7 -9.4,-4.1; 8 -9,4.1; 9 -8.6,-4.1; 10 -8.2,4.1; 11 -7.8,-4.1; 12 -7.4,4.1; 13 -7,-4.1; 14 -6.6,4.1; 15 -6.2,-4.1; 16 -5.8,4.1; 17 -2.2,-4.1; 18 -1.8,4.1; 19 -1.4,-4.1; 20 -1,4.1; 21 -0.6,-4.1; 22 -0.2,4.1; 23 0.2,-4.1; 24 0.6,4.1; 25 1,-4.1; 26 1.4,4.1; 27 1.8,-4.1; 28 2.2,4.1; 29 2.6,-4.1; 30 3,4.1; 31 3.4,-4.1; 32 3.8,4.1; 33 4.2,-4.1; 34 4.6,4.1; 35 5,-4.1; 36 5.4,4.1; 37 5.8,-4.1; 38 6.2,4.1; 39 6.6,-4.1; 40 7,4.1; 41 7.4,-4.1; 42 7.8,4.1; 43 8.2,-4.1; 44 8.6,4.1; 45 9,-4.1; 46 9.4,4.1; 47 9.8,-4.1; 48 10.2,4.1; 49 10.6,-4.1; 50 11,4.1; 51 11.4,-4.1; 52 11.8,4.1 | smd 2.3 x 3.2: S1 -14.65,-3.5; S2 14.65,-3.5 | hole 1.65: -12.5,0 | hole 1.15: 12.5,0
480994000 = smd 4.8 x 3: 1 -12.1,-3.15; 2 12.1,-3.15; 3 -12.1,3.15; 4 12.1,3.15 | hole 1.65: -12.1,0 | hole 1.15: 12.1,0
GCT_SIM8060-6-0-14-00-A = smd 0.9 x 1.2: C1 -3.175,6.8; C2 -0.635,6.8; C3 1.905,6.8; C5 -1.905,6.8; C6 0.635,6.8; C7 3.175,6.8 | smd 1.3 x 1.8: S1 -6.15,2.7; S2 6.15,2.7; S3 6.15,-6.1; S4 -6.15,-6.1
HARWIN_S8411-45R = smd 2.3 x 4.5: N 0,8.425; P 0,-7.975 | hole 1.05: 0,3.725 | hole 1.3: 0,-3.725
GCT_MEM2067-02-180-00-A_REVB = smd 0.8 x 1.2: 1 3.225,-2.625; 2 2.125,-2.625; 3 1.025,-2.625; 4 -0.075,-2.625; 5 -1.175,-2.625; 6 -2.275,-2.625; 7 -3.375,-2.625; 8 -4.475,-2.625 | smd 1.5 x 2: 9 -6.945,-4.825; 10 -6.945,3.375; 11 6.945,3.375; 12 6.945,-4.825
IND_MDH7045C-220MA=P3 = smd 2.4 x 2.2: 1 -2.85,0; 2 2.85,0
SOT95P280X145-6N = smd 1.21 x 0.59: 1 -1.255,0.95; 2 -1.255,0; 3 -1.255,-0.95; 4 1.255,-0.95; 5 1.255,0; 6 1.255,0.95
SOT23-3 = smd 0.8 x 0.9: 1 -0.95,-1; 2 0.95,-1; 3 0,1.1
R0805 = smd 1.3 x 1.5: 1 -0.95,0; 2 0.95,0
R1206 = smd 1.6 x 1.803: 1 -1.422,0; 2 1.422,0
CONV_TPS552892RYQR = smd 0.6 x 0.25: 1 -2.4,0.75; 2 -2.4,0.25; 3 -2.4,-0.25; 4 -2.4,-0.75; 14 2.4,-0.75; 15 2.4,-0.25; 16 2.4,0.25; 17 2.4,0.75 | smd 0.25 x 0.65: 5 -2.04,-1.375; 13 2.04,-1.375; 18 2.04,1.375; 21 -2.04,1.375 | smd 0.25 x 0.6: 6 -1.54,-1.4; 12 1.54,-1.4; 19 1.54,1.4; 20 -1.54,1.4 | smd 0.25 x 3.4: 7 -1.04,0; 8 -0.54,0; 10 0.54,0; 11 1.04,0 | smd 0.25 x 1.2: 9 0,0
SOT23-6 = smd 0.55 x 1.2: 1 -0.95,-1.3; 2 0,-1.3; 3 0.95,-1.3; 4 0.95,1.3; 5 0,1.3; 6 -0.95,1.3
SOP65P780X200-28N = smd 1.5 x 0.4: 1 -3.625,4.225; 2 -3.625,3.575; 3 -3.625,2.925; 4 -3.625,2.275; 5 -3.625,1.625; 6 -3.625,0.975; 7 -3.625,0.325; 8 -3.625,-0.325; 9 -3.625,-0.975; 10 -3.625,-1.625; 11 -3.625,-2.275; 12 -3.625,-2.925; 13 -3.625,-3.575; 14 -3.625,-4.225; 15 3.625,-4.225; 16 3.625,-3.575; 17 3.625,-2.925; 18 3.625,-2.275; 19 3.625,-1.625; 20 3.625,-0.975; 21 3.625,-0.325; 22 3.625,0.325; 23 3.625,0.975; 24 3.625,1.625; 25 3.625,2.275; 26 3.625,2.925; 27 3.625,3.575; 28 3.625,4.225
QFN50P300X300X100-17N = smd 0.86 x 0.26: 1 -1.435,0.75; 2 -1.435,0.25; 3 -1.435,-0.25; 4 -1.435,-0.75; 9 1.435,-0.75; 10 1.435,-0.25; 11 1.435,0.25; 12 1.435,0.75 | smd 0.26 x 0.86: 5 -0.75,-1.435; 6 -0.25,-1.435; 7 0.25,-1.435; 8 0.75,-1.435; 13 0.75,1.435; 14 0.25,1.435; 15 -0.25,1.435; 16 -0.75,1.435 | smd 1.68 x 1.68: 17 0,0 | drill 0.2 pad 0.4: 18 0,0; 19 -0.58,0.58; 20 0.58,0.58; 21 -0.58,-0.58; 22 0.58,-0.58
MODULE_ESP32-WROOM-32D-N4 = smd 2 x 0.9: 1 -8.5,5.26; 2 -8.5,3.99; 3 -8.5,2.72; 4 -8.5,1.45; 5 -8.5,0.18; 6 -8.5,-1.09; 7 -8.5,-2.36; 8 -8.5,-3.63; 9 -8.5,-4.9; 10 -8.5,-6.17; 11 -8.5,-7.44; 12 -8.5,-8.71; 13 -8.5,-9.98; 14 -8.5,-11.25; 25 8.5,-11.25; 26 8.5,-9.98; 27 8.5,-8.71; 28 8.5,-7.44; 29 8.5,-6.17; 30 8.5,-4.9; 31 8.5,-3.63; 32 8.5,-2.36; 33 8.5,-1.09; 34 8.5,0.18; 35 8.5,1.45; 36 8.5,2.72; 37 8.5,3.99; 38 8.5,5.26 | smd 0.9 x 2: 15 -5.715,-12.25; 16 -4.445,-12.25; 17 -3.175,-12.25; 18 -1.905,-12.25; 19 -0.635,-12.25; 20 0.635,-12.25; 21 1.905,-12.25; 22 3.175,-12.25; 23 4.445,-12.25; 24 5.715,-12.25 | smd 1.33 x 1.33: 39_1 -2.835,-0.405; 39_2 -1,-0.405; 39_3 0.835,-0.405; 39_4 -2.835,-2.24; 39_5 -1,-2.24; 39_6 0.835,-2.24; 39_7 -2.835,-4.075; 39_8 -1,-4.075; 39_9 0.835,-4.075 | drill 0.2 pad 0.3: 39_10 -1.917,-0.405; 39_11 -0.083,-0.405; 39_12 -2.835,-1.323; 39_13 -1,-1.323; 39_14 0.835,-1.323; 39_15 -1.917,-2.24; 39_16 -0.083,-2.24; 39_17 -2.835,-3.158; 39_18 -1,-3.158; 39_19 0.835,-3.158; 39_20 -1.917,-4.075; 39_21 -0.083,-4.075
IC_BQ27441DRZR-G1A = smd 0.4 x 0.2: 1 -1.975,1; 2 -1.975,0.6; 3 -1.975,0.2; 4 -1.975,-0.2; 5 -1.975,-0.6; 6 -1.975,-1; 7 1.975,-1; 8 1.975,-0.6; 9 1.975,-0.2; 10 1.975,0.2; 11 1.975,0.6; 12 1.975,1 | smd 2.45 x 1.95: 13 0,0 | drill 0.3 pad 0.5: 14 -0.9,0.5; 15 0,0.5; 16 0.9,0.5; 17 -0.9,-0.5; 18 0,-0.5; 19 0.9,-0.5
JST_B2B-PH-SM4-TB(LF)(SN) = smd 1 x 5.5: 1 -1.05,-1.8; 2 0.95,-1.8 | smd 1.6 x 3: 3 -3.45,0.45; 4 3.35,0.45
SS-2235S = smd 1.2 x 1.7: 1 -2.54,3.36; 2 -0.04,3.36; 3 2.46,3.36; 4 -2.54,-2.54; 5 -0.04,-2.54; 6 2.46,-2.54
SMT-JUMPER-2_NC = smd 0.66 x 1.27: 1 -0.521,0; 2 0.521,0

### Placement (x,y rotation side)
C1  47.24,27.94 90 top
C2  40.13,66.55 0 top
C3  42.16,28.45 90 top
C4  44.2,28.45 90 top
C5  47.24,33.02 270 top
C6  42.16,60.96 270 top
C7  44.2,32.51 270 top
C8  42.16,32.51 270 top
C9  42.16,24.38 90 top
C10  34.04,28.45 90 top
C11  34.04,32.51 270 top
C12  36.07,36.58 90 top
C13  32.51,16.26 90 top
C14  42.67,10.67 0 top
C15  39.12,1.02 0 bottom
C16  11.68,59.44 90 top
C17  15.24,-13.72 90 top  (outside the outline)
C18  3.56,7.11 270 bottom
C19  7.62,7.11 270 bottom
C20  11.68,7.11 90 bottom
C21  11.68,63.5 90 top
C22  11.68,3.05 0 bottom
C23  1.52,7.11 270 bottom
C24  28.96,2.03 180 bottom
C25  2.03,26.92 0 bottom
C26  6.1,19.3 90 top
C27  10.16,15.75 0 top
C28  42.67,42.16 90 top
C29  13.72,63.5 90 top
C30  38.1,60.96 270 top
C31  17.27,23.37 90 top
C32  16.26,10.16 270 top
C33  36.58,-12.19 90 top  (outside the outline)
C34  21.84,-13.72 90 top  (outside the outline)
C35  11.18,8.64 0 top
C36  23.37,3.05 0 top
IC1  41.66,51.31 180 top
J1  2.03,60.96 90 top
J2  2.03,52.83 90 top
J3  2.03,44.7 90 top
J4  2.03,36.58 90 top
J5  2.03,28.45 90 top
J6  2.03,17.78 90 top
J7  8.13,33.02 90 top
J8  38.61,1.02 0 top
J9  33.02,10.16 0 bottom
J10  33.02,59.44 0 bottom
J11  6.6,18.29 180 bottom
J12  8.13,57.4 0 bottom
J13  7.62,37.08 180 bottom
L1  24.89,20.32 180 top
Q1  12.19,3.05 0 top
Q2  14.73,37.08 0 top
Q3  46.23,19.81 270 top
Q4  14.73,32.51 0 top
Q5  14.73,27.94 0 top
Q6  46.23,12.7 270 top
R1  44.2,24.38 90 top
R2  40.13,24.38 90 top
R3  38.1,24.38 90 top
R4  40.13,36.58 270 top
R5  38.1,36.58 270 top
R6  34.04,36.58 90 top
R7  34.04,24.38 270 top
R8  36.07,24.38 270 top
R9  13.21,23.37 270 top
R10  34.54,8.64 0 top
R11  42.67,8.64 180 top
R12  23.37,5.08 180 top
R13  15.24,23.37 90 top
R14  38.1,43.18 0 top
R15  38.1,41.15 0 top
R16  23.37,1.02 180 top
R17  18.29,10.16 270 top
R18  13.72,59.44 90 top
R19  13.72,7.11 270 bottom
R20  9.65,7.11 270 bottom
R21  5.59,7.11 270 bottom
R22  11.68,51.31 90 top
R23  13.72,51.31 90 top
R24  12.19,37.08 270 top
R25  17.27,37.08 270 top
R26  12.19,32.51 270 top
R27  17.27,32.51 270 top
R28  12.19,27.94 270 top
R29  17.27,27.94 270 top
R31  45.72,16.26 90 top
R32  47.75,16.26 270 top
R33  19.3,23.37 90 top
R34  11.18,11.18 0 top
R35  10.16,-13.72 90 top  (outside the outline)
R36  44.7,42.16 270 top
R37  46.74,42.16 270 top
U1  38.1,30.48 90 top
U2  17.78,3.05 270 top
U3  39.12,16.26 270 top
U4  17.27,17.78 0 top
U5  24.89,53.85 0 top
U6  10.16,19.3 0 top
U$1  3.56,10.16 90 top
U$2  7.11,28.96 0 bottom
U$3  78.23,14.73 0 top  (outside the outline)
U$5  37.59,8.64 90 top
U$6  40.13,8.64 90 top

### Tracks (layer width: path | path; a pad name or v marks a point on that pad's centre or on a via)
!DTR  (2 unrouted)
!RTS  (2 unrouted)
+1.8V  (1 unrouted)
+3V3  (22 unrouted)
+3V3INT  (3 unrouted)
BOOT  (2 unrouted)
D+  (2 unrouted)
D-  (2 unrouted)
FET1  (2 unrouted)
FET2  (2 unrouted)
FET3  (2 unrouted)
GND  (152 unrouted)
GND_ISO  (6 unrouted)
GPOUT  (1 unrouted)
IO14  (1 unrouted)
IO25  (1 unrouted)
IO26  (2 unrouted)
IO27  (2 unrouted)
IO28  (2 unrouted)
IO33  (1 unrouted)
IO35  (2 unrouted)
MISO  (1 unrouted)
MODEM_RX  (1 unrouted)
MODEM_TX  (1 unrouted)
MOSI  (1 unrouted)
N$1  (1 unrouted)
N$2  (1 unrouted)
N$3  (1 unrouted)
N$4  (1 unrouted)
N$5  (1 unrouted)
N$6  (4 unrouted)
N$7  (2 unrouted)
N$8  (2 unrouted)
N$9  (1 unrouted)
N$10  (2 unrouted)
N$11  (1 unrouted)
N$12  (2 unrouted)
N$13  (1 unrouted)
N$14  (1 unrouted)
N$15  (1 unrouted)
N$16  (1 unrouted)
N$17  (2 unrouted)
N$18  (1 unrouted)
N$19  (1 unrouted)
N$20  (1 unrouted)
N$21  (1 unrouted)
N$22  (1 unrouted)
N$23  (1 unrouted)
N$24  (1 unrouted)
N$25  (1 unrouted)
N$26  (1 unrouted)
N$27  (1 unrouted)
N$28  (1 unrouted)
N$31  (1 unrouted)
N$33  (1 unrouted)
N$35  (1 unrouted)
RST  (3 unrouted)
SC_CLK  (1 unrouted)
SC_DATA  (1 unrouted)
SC_RST  (1 unrouted)
SCK  (1 unrouted)
SCL  (5 unrouted)
SD_CS  (1 unrouted)
SDA  (5 unrouted)
SIM_CLK  (2 unrouted)
SIM_DATA  (2 unrouted)
SIM_RST  (2 unrouted)
SIM_VDD  (2 unrouted)
VBAT  (5 unrouted)
  Top 0.61: U$1.2 9.69,11.11 R34.1
VCC  (9 unrouted)
VCC_USB  (7 unrouted)
VCCINT  (4 unrouted)
VREG  (5 unrouted)